# EAGLE design A4a ESP32 (EAGLE 9.6.1)
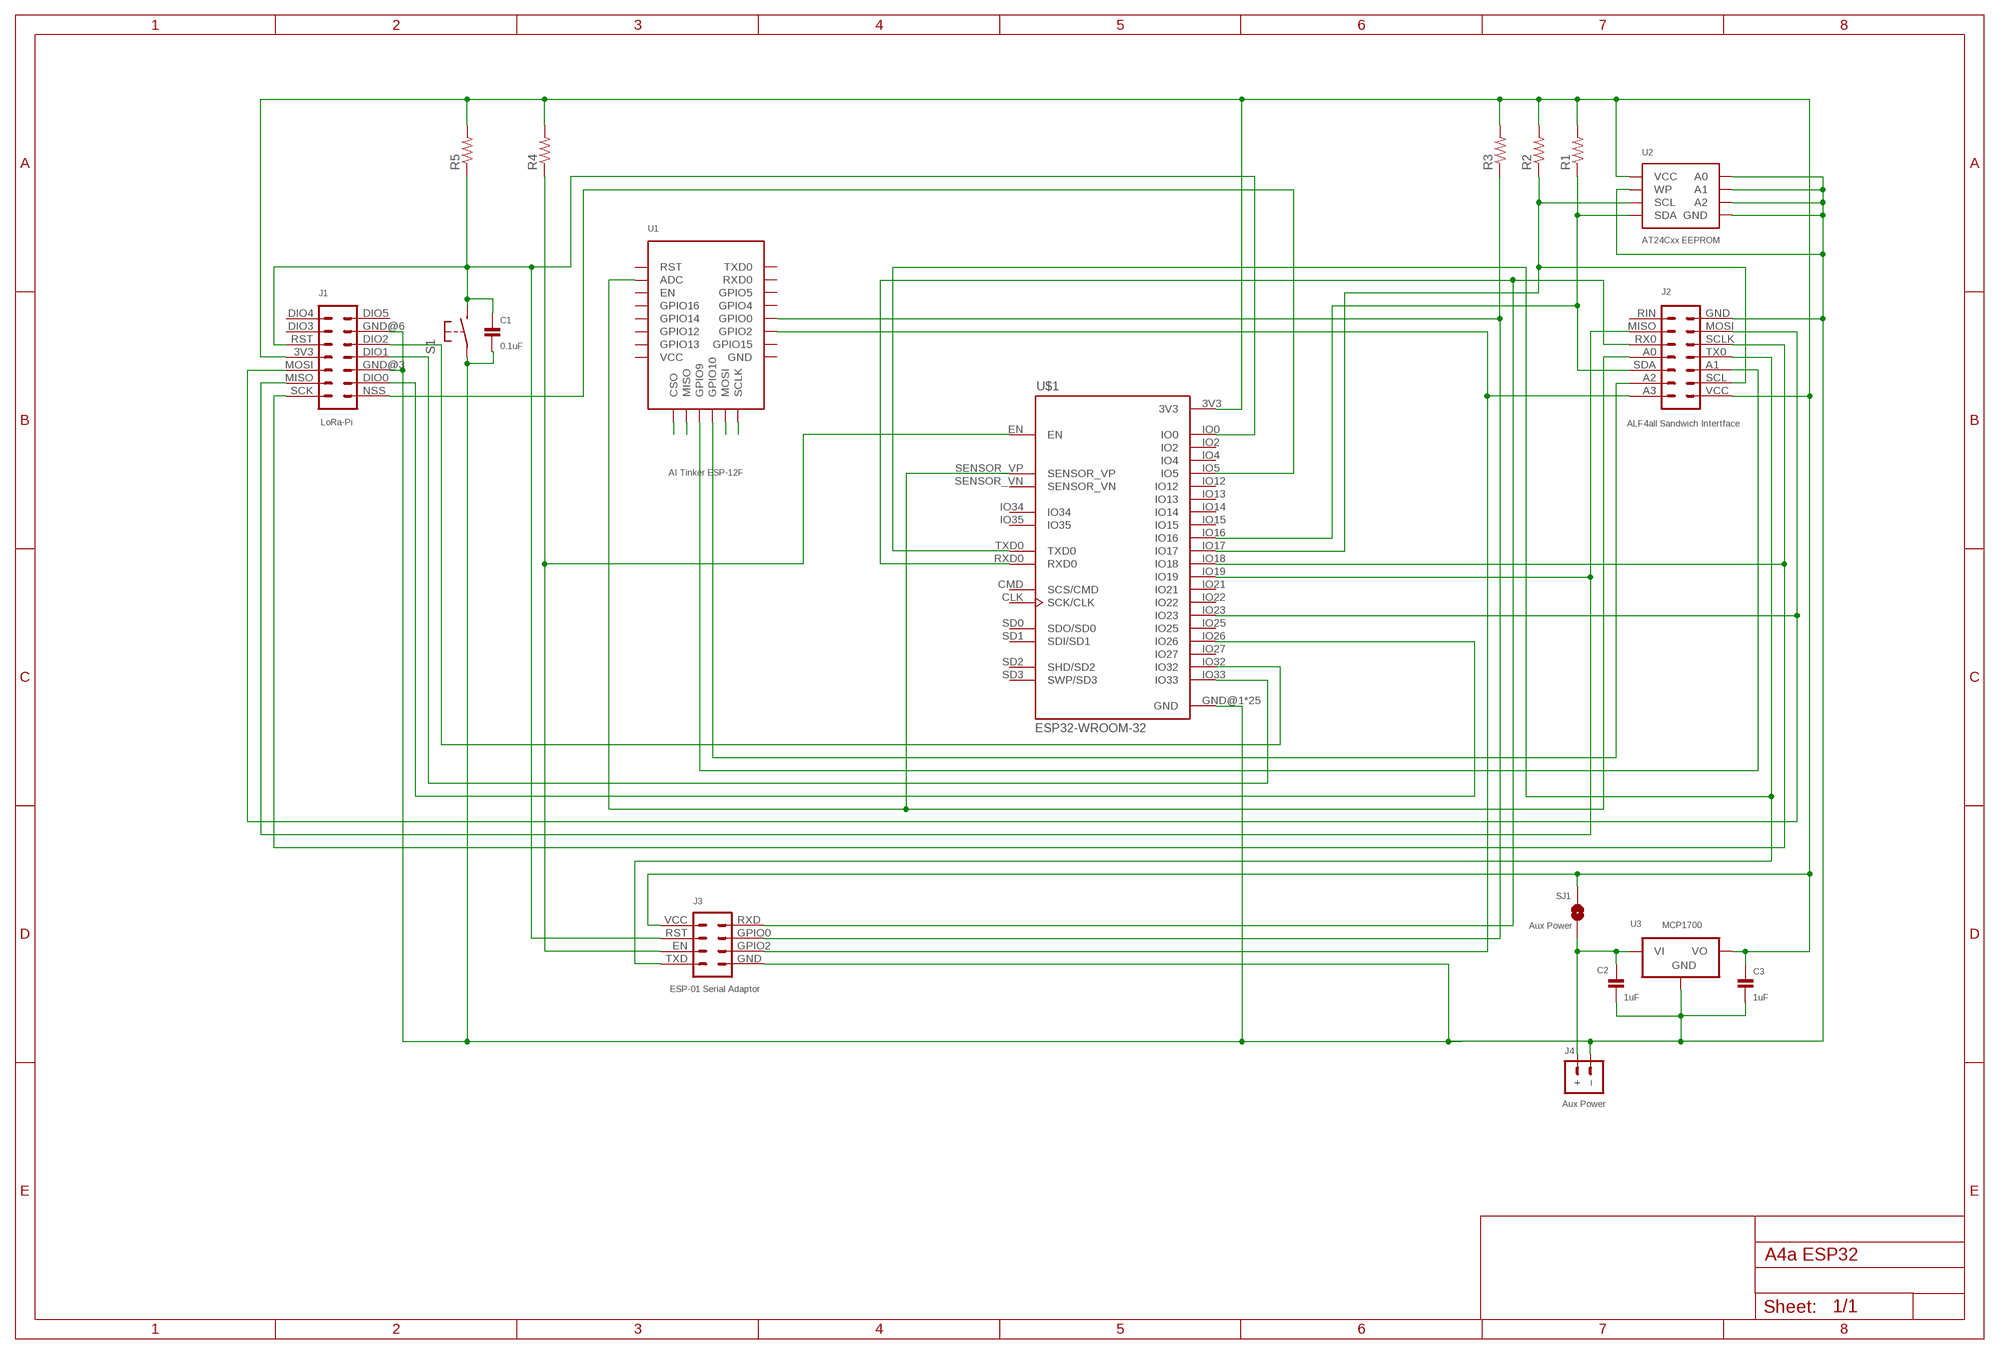
[diagram p0: schematic, sheet 1]

## Parts
C1  0.1uF  CAPACITOR  [C0805]
C2  1uF  CAPACITOR  [C0805]
C3  1uF  CAPACITOR  [C0805]
J1  LoRa-Pi  RFM95W-PI-HEADER  [RFM95W-PI]
J2  ALF4all Sandwich Intertface  HEADER-2X7-ALF4ALL-PROCESSOR-B  [CONN_2X7-ALF4ALL-PROCESSOR-B]
J3  ESP-01 Serial Adaptor  ESP-01-SERIAL-ADAPTOR  [CONN_2X4-ESP-01-SERIAL]
J4  Aux Power  JST-PH2.0-2-MALE-HORIZONTALJST-PTH-2  [JST-PH2.0-2-HORIZONTAL]
R1  RESISTOR-VIA-1  [R0805-VIA-1]
R2  RESISTORR0805  [R0805]
R3  RESISTORR0805  [R0805]
R4  RESISTORR0805  [R0805]
R5  RESISTORR0805  [R0805]
S1  SWITCH-MOMENTARY-2-PIN  [SWITCH-2-PAD]
SJ1  Aux Power  SJ  [SJ]
U1  AI Tinker ESP-12F  ESP-12E/F-WITH-VIAS  [ESP-12E/F-WITH-VIAS]
U2  AT24Cxx EEPROM  AT24CXX-EEPROM-VIA-7  [SOP-8-WITH-VIA-7]
U3  MCP1700  MCP1700-VIA-GND  [SOT-23-3-VIA-GND]
U$1  ESP32-WROOM-32  [ESP32-WROOM-32]

## Nets
GND: C1.2 C2.2 C3.2 J1.GND@3 J1.GND@6 J2.GND J3.GND J4.-(–) S1.P$1(P) U2.P$1(A0) U2.P$2(A1) U2.P$3(A2) U2.P$4(GND) U2.P$7(WP) U2.P$7@VIA(WP) U3.GND U3.GND@VIA(GND) U$1.GND@1(GND) U$1.GND@15(GND) U$1.GND@38(GND) U$1.TP(GND) U$1.TP@P1(GND) U$1.TP@P2(GND) U$1.TP@P3(GND) U$1.TP@P4(GND) U$1.TP@P5(GND) U$1.TP@P6(GND) U$1.TP@P7(GND) U$1.TP@P8(GND) U$1.TP@P9(GND) U$1.TP@V1(GND) U$1.TP@V2(GND) U$1.TP@V3(GND) U$1.TP@V4(GND) U$1.TP@V5(GND) U$1.TP@V6(GND) U$1.TP@V7(GND) U$1.TP@V8(GND) U$1.TP@V9(GND) U$1.TP@V10(GND) U$1.TP@V11(GND) U$1.TP@V12(GND)
N$1: U1.CS0(CSO) U1.CS0@VIA(CSO)
N$2: J1.NSS U$1.IO5
N$3: J1.SCK J2.SCLK U$1.IO18
N$4: C1.1 J1.RST J3.RST R5.1 S1.P$2(S) U$1.IO0
N$5: J1.MISO J2.MISO U$1.IO19
N$6: J1.MOSI J2.MOSI U$1.IO23
N$7: U1.MISO U1.MISO@VIA(MISO)
N$8: J3.EN R4.1 U$1.EN
N$9: J2.A0 U1.ADC U1.ADC@VIA(ADC) U$1.SENSOR_VP
N$10: J2.TX0 J3.TXD U$1.TXD0
N$11: J2.A3 J3.GPIO2 U1.GPIO2 U1.GPIO2@VIA(GPIO2)
N$12: J2.SCL R2.1 U2.P$6(SCL) U$1.IO17
N$13: J3.GPIO0 R3.1 U1.GPIO0 U1.GPIO0@VIA(GPIO0)
N$14: J2.SDA R1.1 R1.1@VIA U2.P$5(SDA) U$1.IO16
N$15: J2.A1 U1.GPIO9 U1.GPIO9@VIA(GPIO9)
N$16: J2.RX0 J3.RXD U$1.RXD0
N$17: J2.A2 U1.GPIO10 U1.GPIO10@VIA(GPIO10)
N$18: J1.DIO0 U$1.IO26
N$19: U1.MOSI U1.MOSI@VIA(MOSI)
N$20: U1.SCLK U1.SCLK@VIA(SCLK)
N$21: J1.DIO1 U$1.IO33
N$22: J1.DIO2 U$1.IO32
N$24: C2.1 J4.+ SJ1.1 U3.VIN(VI)
VCC: C3.1 J1.3V3 J2.VCC J3.VCC R1.2 R2.2 R3.2 R4.2 R5.2 SJ1.2 U2.P$8(VCC) U3.VOUT(VO) U$1.3V3
Unconnected: J1.DIO3 J1.DIO4 J1.DIO5 J2.RIN U1.EN U1.EN@VIA(EN) U1.GND U1.GPIO4 U1.GPIO4@VIA(GPIO4) U1.GPIO5 U1.GPIO5@VIA(GPIO5) U1.GPIO12 U1.GPIO12@VIA(GPIO12) U1.GPIO13 U1.GPIO13@VIA(GPIO13) U1.GPIO14 U1.GPIO14@VIA(GPIO14) U1.GPIO15 U1.GPIO15@VIA(GPIO15) U1.GPIO16 U1.GPIO16@VIA(GPIO16) U1.RST U1.RST@VIA(RST) U1.RXD0 U1.RXD@VIA(RXD0) U1.TXD0 U1.TXD@VIA(TXD0) U1.VCC U1.VCC@VIA(VCC) U$1.CLK(SCK/CLK) U$1.CMD(SCS/CMD) U$1.IO2 U$1.IO4 U$1.IO12 U$1.IO13 U$1.IO14 U$1.IO15 U$1.IO21 U$1.IO22 U$1.IO25 U$1.IO27 U$1.IO34 U$1.IO35 U$1.SD0(SDO/SD0) U$1.SD1(SDI/SD1) U$1.SD2(SHD/SD2) U$1.SD3(SWP/SD3) U$1.SENSOR_VN

## Library data of the parts
C1-C3 = digitalconcepts:CAPACITOR: 0805 Capacitor
J1 = digitalconcepts:RFM95W-PI-HEADER: RFM95W LoRa Wireless Transceiver Raspberry Pi Daughter Board
J2 = digitalconcepts:HEADER-2X7-ALF4ALL-PROCESSOR-B: ALF4all 'Sandwich' Processor (Bottom) 2x7 Pin Header Header soldered to underside of PCB
J3 = digitalconcepts:ESP-01-SERIAL-ADAPTOR: ESP-01 Serial Adpator
J4 = digitalconcepts:JST-PH2.0-2-MALE-HORIZONTAL: Multi connection point. Often used as Generic Header-pin footprint for 0.1 inch spaced/style header connections On any of the 0.1 inch spaced packages, you can populate with these: Break Away Headers - Straight <https://www.sparkfun.com/products/116> (PRT-00116) Break Away Male Headers - Right Angle <https://www.sparkfun.com/products/553> (PRT-00553) Female Headers <https://www.sparkfun.com/products/115> (PRT-00115) Break Away Headers - Machine Pin <https://www.sparkfun.com/products/117> (PRT-00117) Break Away Female Headers - Swiss Machine Pin <https://www.sparkfun.com/products/743> (PRT-00743) For SCREWTERMINALS and SPRING TERMINALS visit here: Screw Terimnals on SparkFun.com <https://www.sparkfun.com/search/results?term=Screw+Terminals> (5mm/3.5mm/2.54mm spacing) This device is also useful as a general connection point to wire up your design to another part of your project. Our various solder wires solder well into these plated through hole pads. Hook-Up Wire - Assortment (Stranded, 22 AWG) <https://www.sparkfun.com/products/11375> (PRT-11375) Hook-Up Wire - Assortment (Solid Core, 22 AWG) <https://www.sparkfun.com/products/11367> (PRT-11367) View the entire wire category on our website here <https://www.sparkfun.com/categories/141> Special notes: Molex polarized connector foot print use with: PRT-08233 with associated crimp pins and housings. 2.54_SCREWTERM for use with PRT-10571. 3.5mm Screw Terminal footprints for PRT-08084 5mm Screw Terminal footprints for use with PRT-08432; PROD_ID: CONN-09863; SKU: PRT-09914
R1 = digitalconcepts:RESISTOR-VIA-1: Resistor with via on Pad 1
R2-R5 = digitalconcepts:RESISTOR: Resistor; SPICEPREFIX: R
S1 = digitalconcepts:SWITCH-MOMENTARY-2-PIN: 2 Pin Momentary Switch
SJ1 = digitalconcepts:SJ: Solder Jumper
U1 = digitalconcepts:ESP-12E/F-WITH-VIAS: AI Thinker ESP-12E/F MCU with Vias
U2 = digitalconcepts:AT24CXX-EEPROM-VIA-7: AT24Cxx EEPROM SOP-8
U3 = digitalconcepts:MCP1700-VIA-GND: MCP1700 Low Quiescent Current LDO Voltage Regulator
U$1 = digitalconcepts:ESP32-WROOM-32: ESP32-WROOM-32 MCU

## Board
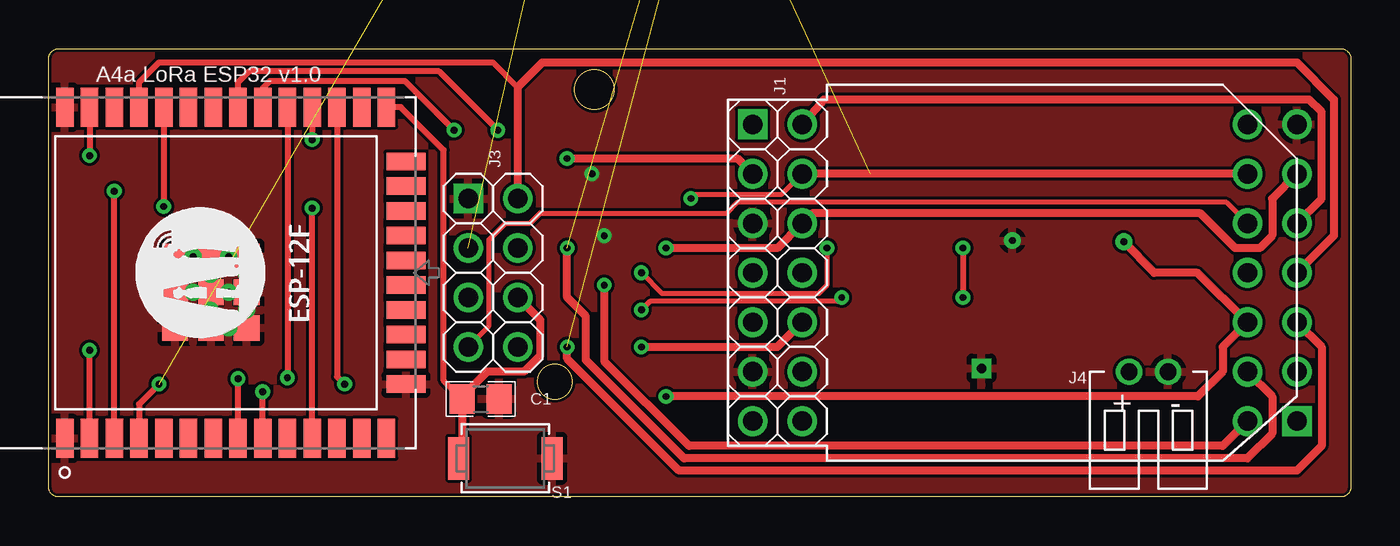
[diagram p1: board, top side]
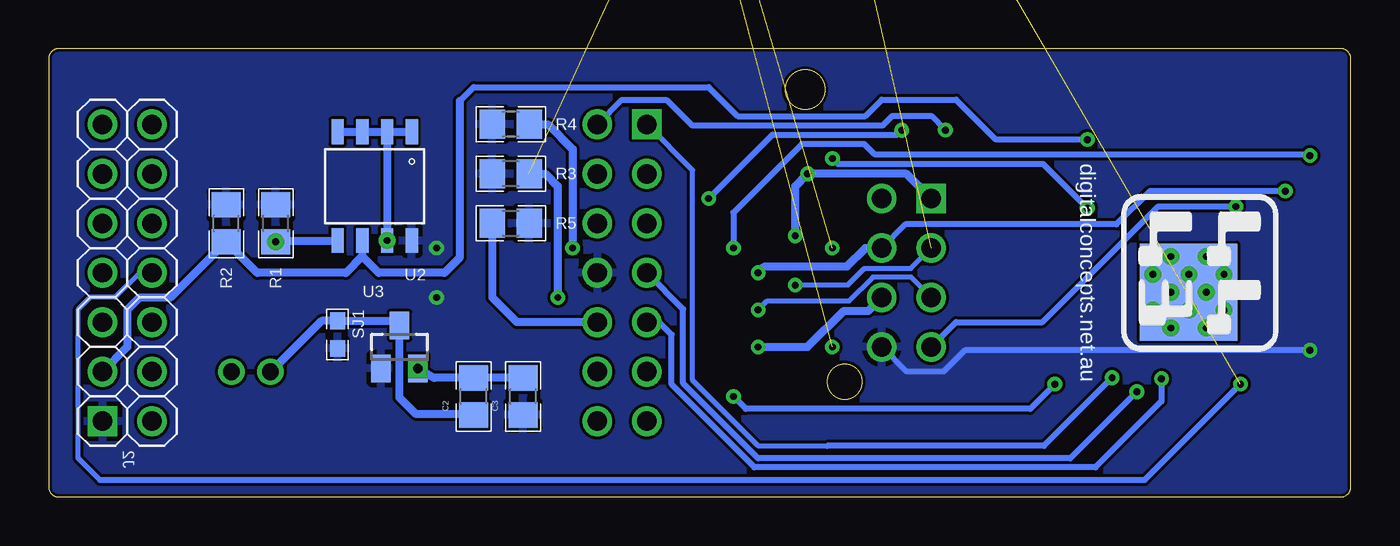
[diagram p2: board, bottom side, seen from below]

Size 66.85 x 23 mm. Coordinates in mm from the lower left corner, seen from the top.
Outline: 66.39,23 66.42,23 66.45,22.99 66.49,22.98 66.52,22.97 66.55,22.96 66.58,22.95 66.61,22.93 66.63,22.91 66.66,22.9 66.68,22.88 66.71,22.85 66.73,22.83 66.75,22.81 66.77,22.78 66.78,22.75 66.8,22.72 66.81,22.69 66.83,22.66 66.84,22.63 66.84,22.6 66.85,22.57 66.85,22.53 66.85,0.47 66.85,0.43 66.84,0.4 66.84,0.37 66.83,0.34 66.81,0.31 66.8,0.28 66.78,0.25 66.77,0.22 66.75,0.19 66.73,0.17 66.68,0.12 66.66,0.1 66.63,0.09 66.61,0.07 66.58,0.05 66.55,0.04 66.52,0.03 66.49,0.02 66.45,0.01 66.42,0 66.39,0 0.47,0 0.43,0 0.4,0.01 0.37,0.02 0.34,0.03 0.28,0.05 0.25,0.07 0.22,0.09 0.19,0.1 0.17,0.12 0.12,0.17 0.1,0.19 0.09,0.22 0.07,0.25 0.05,0.28 0.04,0.31 0.03,0.34 0.02,0.37 0.01,0.4 0,0.43 0,0.47 0,22.53 0,22.57 0.01,22.6 0.02,22.63 0.03,22.66 0.04,22.69 0.05,22.72 0.07,22.75 0.09,22.78 0.1,22.81 0.12,22.83 0.15,22.85 0.17,22.88 0.19,22.9 0.22,22.91 0.25,22.93 0.28,22.95 0.34,22.97 0.37,22.98 0.4,22.99 0.43,23 0.47,23 66.39,23
Outline: circle at 28.02,20.9 radius 1.02
Outline: circle at 25.98,5.91 radius 0.9
Copper layers (1*16): Top 0.035mm / dielectric 1.5mm / Bottom 0.035mm
Design rules "default *": minimum track width 6mil, minimum drill 0.35mm, track to track 6mil, track to pad 6mil, pad to pad 6mil, via to via 6mil, smd to smd 6mil, copper to edge 6mil, drill to drill 6mil, minimum pad ring 10mil, minimum via ring 8mil, stop-mask expansion 4mil, vias tented up to drill 0mil, thermal gap 10mil

### Footprints (pad centres in the part's own frame; a part is rotated, then mirrored left to right if it is on the bottom)
C0805 = smd 1.3 x 1.5: 1 -0.95,0; 2 0.95,0
RFM95W-PI = drill 1 pad 1.524: 3V3 7.62,2.54; DIO0 2.54,0; DIO1 7.62,0; DIO2 10.16,0; DIO3 12.7,2.54; DIO4 15.24,2.54; DIO5 15.24,0; GND@3 5.08,0; GND@6 12.7,0; MISO 2.54,2.54; MOSI 5.08,2.54; RST 10.16,2.54; SCK 0,2.54 | drill 1 pad 1.524 square: NSS 0,0
CONN_2X7-ALF4ALL-PROCESSOR-B = drill 1 pad 1.524: A0 7.62,2.54; A1 5.08,0; A2 2.54,2.54; A3 0,2.54; GND 15.24,0; MISO 12.7,2.54; MOSI 12.7,0; RIN 15.24,2.54; RX0 10.16,2.54; SCL 2.54,0; SCLK 10.16,0; SDA 5.08,2.54; TX0 7.62,0 | drill 1 pad 1.524 square: VCC 0,0
CONN_2X4-ESP-01-SERIAL = drill 1 pad 1.524: EN 2.54,2.54; GPIO0 5.08,0; GPIO2 2.54,0; RST 5.08,2.54; RXD 7.62,0; TXD 0,2.54; VCC 7.62,2.54 | drill 1 pad 1.524 square: GND 0,0
JST-PH2.0-2-HORIZONTAL = drill 0.85: + 1,0; - -1,0
R0805-VIA-1 = smd 1.3 x 1.5: 1 -0.95,0; 2 0.95,0 | drill 0.35 pad 0.61: 1@VIA -0.95,0
R0805 = smd 1.3 x 1.5: 1 -0.95,0; 2 0.95,0
SWITCH-2-PAD = smd 1.067 x 2.184: P$1 -2.4,0; P$2 2.4,0
SJ = smd 0.864 x 0.762: 1 -0.711,0; 2 0.711,0
ESP-12E/F-WITH-VIAS = smd 2 x 1.2: ADC -7.5,5; EN -7.5,3; GND 7.5,-7; GPIO0 7.5,-1; GPIO2 7.5,-3; GPIO4 7.5,1; GPIO5 7.5,3; GPIO12 -7.5,-3; GPIO13 -7.5,-5; GPIO14 -7.5,-1; GPIO15 7.5,-5; GPIO16 -7.5,1; RST -7.5,7; RXD0 7.5,5; TXD0 7.5,7; VCC -7.5,-7 | drill 0.6 square: ADC@VIA -7.5,5; CS0@VIA -5,-8.5; EN@VIA -7.5,3; GPIO0@VIA 7.5,-1; GPIO2@VIA 7.5,-3; GPIO4@VIA 7.5,1; GPIO5@VIA 7.5,3; GPIO12@VIA -7.5,-3; GPIO13@VIA -7.5,-5; GPIO14@VIA -7.5,-1; GPIO15@VIA 7.5,-5; GPIO16@VIA -7.5,1; RST@VIA -7.5,7; RXD@VIA 7.5,5; TXD@VIA 7.5,7; VCC@VIA -7.5,-7 | smd 1.1 x 1.7: CS0 -5,-8.5; GPIO9 -1,-8.5; GPIO10 1,-8.5; MISO -3,-8.5; MOSI 3,-8.5; SCLK 5,-8.5 | drill 0.6 pad 1.016 square: GPIO9@VIA -1,-8.5; GPIO10@VIA 1,-8.5; MISO@VIA -3,-8.5; MOSI@VIA 3,-8.5; SCLK@VIA 5,-8.5
SOP-8-WITH-VIA-7 = smd 0.635 x 1.27: P$1 -1.905,-2.794; P$2 -0.635,-2.794; P$3 0.635,-2.794; P$4 1.905,-2.794; P$5 1.905,2.794; P$6 0.635,2.794; P$7 -0.635,2.794; P$8 -1.905,2.794 | drill 0.35 pad 0.61: P$7@VIA -0.635,2.794
SOT-23-3-VIA-GND = smd 1 x 1.4: GND 0.95,-1.1; VIN 0,1.1; VOUT -0.95,-1.1 | drill 0.5 pad 1 square: GND@VIA 0.95,-1.1
ESP32-WROOM-32 = smd 2 x 0.9: 3V3 -8.5,6.74; EN -8.5,5.47; GND@1 -8.5,8.01; GND@38 8.5,8.01; IO0 8.5,-8.5; IO4 8.5,-7.23; IO5 8.5,-3.42; IO12 -8.5,-8.5; IO14 -8.5,-7.23; IO16 8.5,-5.96; IO17 8.5,-4.69; IO18 8.5,-2.15; IO19 8.5,-0.88; IO21 8.5,1.66; IO22 8.5,5.47; IO23 8.5,6.74; IO25 -8.5,-3.42; IO26 -8.5,-4.69; IO27 -8.5,-5.96; IO32 -8.5,-0.88; IO33 -8.5,-2.15; IO34 -8.5,1.66; IO35 -8.5,0.39; NC 8.5,0.39; RXD0 8.5,2.93; SENSOR_VN -8.5,2.93; SENSOR_VP -8.5,4.2; TXD0 8.5,4.2 | smd 0.9 x 2: CLK 0.635,-9.5; CMD -0.635,-9.5; GND@15 -5.715,-9.5; IO2 5.715,-9.5; IO13 -4.445,-9.5; IO15 4.445,-9.5; SD0 1.905,-9.5; SD1 3.175,-9.5; SD2 -3.175,-9.5; SD3 -1.905,-9.5 | smd 5 x 5 bottom: TP -1,0.51 | smd 1.33 x 1.33: TP@P1 -2.835,2.335; TP@P2 -1,2.335; TP@P3 0.835,2.335; TP@P4 -2.835,0.51; TP@P5 -1,0.51; TP@P6 0.835,0.51; TP@P7 -2.835,-1.325; TP@P8 -1,-1.325; TP@P9 0.835,-1.325 | drill 0.35 pad 0.406: TP@V1 -1.917,2.335; TP@V2 -0.083,2.335; TP@V3 -2.835,1.423; TP@V4 -1,1.423; TP@V5 0.835,1.423; TP@V6 -1.917,0.53; TP@V7 -0.083,0.53; TP@V8 -2.835,-0.403; TP@V9 -1,-0.403; TP@V10 0.835,-0.403; TP@V11 -1.917,-1.325; TP@V12 -0.083,-1.325

### Placement (x,y rotation side)
C1  22.17,5.02 0 top
C2  45.03,5.15 90 bottom
C3  42.49,5.15 90 bottom
J1  36.14,19.12 270 top
J2  64.08,3.88 90 top
J3  21.54,15.31 270 top
J4  56.46,6.42 180 top
R1  55.19,14.04 90 bottom
R2  57.73,14.04 90 bottom
R3  43.13,16.58 180 bottom
R4  43.13,19.12 180 bottom
R5  43.13,14.04 0 bottom
S1  23.44,1.98 180 top
SJ1  52.02,8.33 270 bottom
U1  26.62,40.71 90 top  (outside the outline)
U2  50.11,15.95 180 bottom
U3  48.84,7.69 0 bottom
U$1  8.84,11.5 90 top

### Tracks (layer width: path | path; a pad name or v marks a point on that pad's centre or on a via)
GND  (via drill 0.35)  (1 unrouted)
  Top 0.305: U$1.TP@P6 8.31,12.32 U$1.TP@V7 8.33,11.4 U$1.TP 8.33,9.6 U$1.TP@V6 8.33,9.56 U$1.TP@P4
  Bottom 0.406: U2.P$4 U2.P$3 U2.P$2 | U2.P$2 U2.P$1 | U2.P$2 U2.P$7@VIA | J3.GND 22.81,16.58 v27.89,16.58 28.52,15.95 v28.52,13.41 | C3.2 C2.2 47.06,6.1 U3.GND@VIA
  pour Top (rank 3): -1.96,25.47 69.16,25.47 69.16,-2.47 -1.96,-2.47
N$2  (via drill 0.35)
  Top 0.305: U$1.IO5 v12.26,6.11
  Bottom 0.254: 26.89,2.61 30.43,2.61 33.8,5.98 33.8,16.77 J1.NSS
  Bottom 0.305: v12.26,6.11 15.76,2.61 26.89,2.61
N$3  (via drill 0.35)
  Top 0.305: v20.81,18.82 18.3,21.33 11.35,21.33 10.99,20.97 U$1.IO18
  Top 0.406: J2.SCLK 65.35,15.31 65.35,19.76 64.72,20.39 39.8,20.39 J1.SCK
  Bottom 0.305: J1.SCK 37.43,20.38 35.13,20.38 33.82,19.06 24.03,19.06 23.54,19.55 21.54,19.55 v20.81,18.82
N$4  (via drill 0.35)
  Top 0.305: C1.1 20.28,5.97 20.28,17.79 18.07,20 U$1.IO0
  Top 0.406: J3.RST 25.23,9.08 25.23,7.25 24.4,6.42 22.52,6.42 21.22,5.13 C1.1 21.22,2.7 21.04,2.52 S1.P$2 | v30.43,7.69 37.41,7.69 J1.RST
  Bottom 0.406: v30.43,7.69 27.89,7.69 26.04,9.55 24.77,9.55 J3.RST | R5.1 44.08,10.23 42.81,8.96 J1.RST
N$5  (via drill 0.35)
  Top 0.254: v32.97,15.31 33.17,15.51 37.62,15.51 J1.MISO
  Top 0.305: U$1.IO19 9.72,21.27 10.29,21.84 20.03,21.84 v23.06,18.81
  Top 0.406: J2.MISO J1.MISO
  Bottom 0.305: v32.97,15.31 29.69,18.59 23.28,18.59 v23.06,18.81
N$6  (via drill 0.35)
  Top 0.305: U$1.IO23 v2.1,17.51
  Top 0.406: J2.MOSI 62.81,15.31 62.81,13.41 62.18,12.77 60.91,12.77 59.13,14.55 39.19,14.55 J1.MOSI 37.41,12.77 v31.7,12.77
  Bottom 0.305: v2.1,17.51 2.17,17.58 24.46,17.58 24.98,18.1 28.19,18.1 31.7,14.59 v31.7,12.77
N$8  (via drill 0.35)
  Top 0.254: v30.43,11.5 31.5,10.43 39.52,10.43 39.95,10.87 v39.95,12.77
  Top 0.305: U$1.EN v3.37,15.69
  Bottom 0.305: v3.37,15.69 10.31,15.69 12.03,13.98 22.87,13.98 J3.EN
  Bottom 0.406: v39.95,12.77 39.95,17.85 41.22,19.12 R4.1 | J3.EN 24.93,12.77 25.87,11.83 30.1,11.83 v30.43,11.5
N$9  (via drill 0.35)  (1 unrouted)
  Top 0.305: U$1.SENSOR_VP 4.64,4.76 v5.66,5.79
  Bottom 0.254: J2.A0 62.19,11.5 63.46,10.23 64.72,10.23 65.35,9.6 65.35,2 64.21,0.86
  Bottom 0.305: v5.66,5.79 10.59,0.86 64.21,0.86
N$10
  Top 0.305: U$1.TXD0 4.64,21.27 5.66,22.3 22.81,22.3 24.08,21.03
  Top 0.406: J2.TX0 65.99,13.41 65.99,20.39 64.08,22.3 25.35,22.3 24.08,21.03 J3.TXD
N$11  (via drill 0.35)  (1 unrouted)
  Top 0.406: J2.A3 60.27,2.61 32.88,2.61 28.52,6.96 v28.52,10.87
  Bottom 0.254: J3.GPIO2 22.58,11.73 24.98,11.73 25.84,10.87 v28.52,10.87
N$12  (via drill 0.35)
  Top 0.305: U$1.IO17 v13.53,18.33
  Bottom 0.305: 45.74,20.33 45.03,21.03 32.97,21.03 31.48,19.54 24.93,19.54 24.08,20.39 20.27,20.39 18.21,18.33 v13.53,18.33
  Bottom 0.406: J2.SCL 62.81,7.69 62.81,9.6 62.18,10.23 60.59,10.23 R2.1 56.14,11.5 51.59,11.5 50.75,12.34 | 45.74,20.33 45.74,12.3 46.54,11.5 49.91,11.5 50.75,12.34 | U2.P$6 50.75,12.34
N$13  (via drill 0.35)  (1 unrouted)
  Top 0.254: v30.43,9.6 30.86,10.03 40.51,10.03 v40.72,10.23
  Bottom 0.254: J3.GPIO0 22.58,11.27 24.54,11.27 25.76,10.05 29.97,10.05 v30.43,9.6
  Bottom 0.406: v40.72,10.23 40.72,15.95 41.35,16.58 R3.1
N$14  (via drill 0.35)
  Top 0.305: U$1.IO16 14.8,6.18 v15.19,5.79
  Top 0.406: R1.1@VIA 56.75,11.5 58.98,11.5 J2.SDA 60.27,7.69 60.27,6.42 59,5.15 v31.7,5.15
  Bottom 0.305: v15.19,5.79 16.46,4.52 31.06,4.52 v31.7,5.15
  Bottom 0.406: R1.1@VIA 55.14,13.15 U2.P$5
N$15  (via drill 0.35)  (1 unrouted)
  Top 0.406: J2.A1 65.35,7.69 65.35,2.61 64.08,1.34 32.37,1.34 26.62,7.09 v26.62,7.69
N$16  (via drill 0.35)
  Top 0.254: J2.RX0 60.48,15.11 35.35,15.11 34.83,14.56 25.22,14.56 24.7,14.04 23.44,14.04 22.61,13.2 22.61,8.76 J3.RXD
  Top 0.305: U$1.RXD0 v5.91,14.9
  Bottom 0.305: J3.RXD 20.27,8.96 15.82,8.96 9.88,14.91 5.92,14.91 v5.91,14.9
N$17  (via drill 0.35)  (1 unrouted)
  Top 0.406: J2.A2 62.81,5.15 62.81,3.25 61.54,1.98 32.62,1.98 27.58,7.01 27.58,9.27 26.62,10.23 v26.62,12.77
N$18  (via drill 0.35)
  Top 0.305: U$1.IO26 v13.53,14.82
  Top 0.406: J1.DIO0 35.36,17.37 v26.62,17.37
  Bottom 0.305: v13.53,14.82 15.8,17.09 26.34,17.09 v26.62,17.37
N$21  (via drill 0.35)
  Top 0.305: U$1.IO33 v10.99,5.39
  Bottom 0.305: v10.99,5.39 14.4,1.98 30.43,1.98 34.28,5.83 34.28,9.64 J1.DIO1
N$22  (via drill 0.35)
  Top 0.305: U$1.IO32 v9.72,6.06
  Bottom 0.305: v9.72,6.06 9.72,4.91 13.11,1.52 30.62,1.52 34.87,5.77 34.87,8.33 35.51,8.96 J1.DIO2
N$24
  Bottom 0.406: C2.1 45.07,4.24 47.99,4.24 48.84,5.1 U3.VIN 48.84,8.81 49.08,9.04 SJ1.1 52.84,9.04 J4.+
VCC  (via drill 0.35)
  Top 0.305: U$1.3V3 v2.1,7.52 | v46.94,12.77 v46.94,10.23
  Bottom 0.305: v2.1,7.52 19.8,7.52 20.9,6.42 22.81,6.42 J3.VCC
  pour Bottom (rank 3): -0.69,24.2 67.89,24.2 67.89,-1.2 -0.69,-1.2

### Text on the board
tPlace: A4a LoRa ESP32 v1.0
bPlace: digitalconcepts.net.au